# Altium project 8bit-counter.PrjPcb
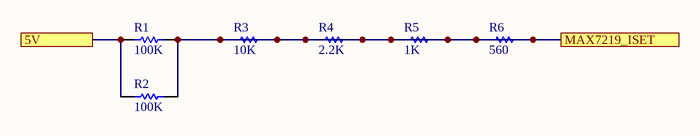
[diagram p0: Equivalent Resistance ISET.SchDoc]
5 sheets, 25 parts. Net scope: flat (ports and power ports of the same name join across sheets).
Sheets:
  Equivalent Resistance ISET.SchDoc
  Equivalent Inductance 3V3.SchDoc
  Equivalent Resistance RFBT 3V3.SchDoc
  3V3 SMPS.SchDoc
  Equivalent Resistance RFBT 5V.SchDoc

## Sheet Equivalent Resistance ISET.SchDoc
size A; SheetNumber: 1; SheetTotal: 3

### Parts
(Parts that share a designator on the sheet are numbered #1, #2 ... from top to bottom, then left to right.)
R1#1  value 100K  (hidden comment: Resistor)
R2#1  value 100K  (hidden comment: Resistor)
R3#1  value 10K  (hidden comment: Resistor)
R4#1  value 2.2K  (hidden comment: Resistor)
R5  value 1K  (hidden comment: Resistor)
R6  value 560  (hidden comment: Resistor)

### Ports
5V (see Equivalent Resistance RFBT 3V3[1B]), MAX7219_ISET (see Equivalent Resistance RFBT 3V3[3B])

### Nets
NetR1#1_1: R1#1.1 R2#1.2 ; port 5V
NetR1#1_2: R1#1.2 R2#1.1 R3#1.1 R3#1.2 R4#1.1 R4#1.2 R5.1 R5.2 R6.1 R6.2 ; port MAX7219_ISET

### Library data of the parts
R1#1 R2#1 R3#1 R4#1 R5 R6 = Resistor: TC1: 0; SimulationGenericComponent: True; TC2: 0

## Sheet Equivalent Inductance 3V3.SchDoc
size A; SheetNumber: 2; SheetTotal: 3
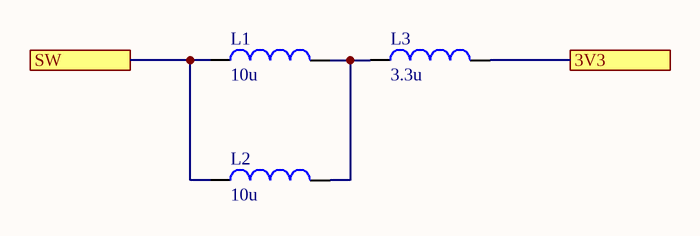
[diagram p1: Equivalent Inductance 3V3.SchDoc]

### Parts
(Parts that share a designator on the sheet are numbered #1, #2 ... from top to bottom, then left to right.)
L1#1  value 10u  (hidden comment: Inductor)
L2  value 10u  (hidden comment: Inductor)
L3  value 3.3u  (hidden comment: Inductor)

### Ports
3V3, SW

### Nets
NetL1#1_1: L1#1.1 L2.1 ; port SW
NetL1#1_2: L1#1.2 L2.2 L3.1
NetL3_2: L3.2 ; port 3V3

### Library data of the parts
L1#1 L2 L3 = Inductor: SimulationGenericComponent: True

## Sheet Equivalent Resistance RFBT 3V3.SchDoc
size A; SheetNumber: 3; SheetTotal: 3
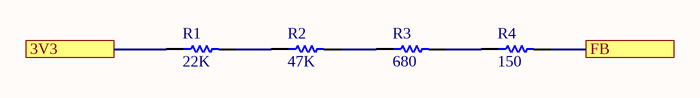
[diagram p2: Equivalent Resistance RFBT 3V3.SchDoc]

### Parts
(Parts that share a designator on the sheet are numbered #1, #2 ... from top to bottom, then left to right.)
R1#2  value 22K  (hidden comment: Resistor)
R2#2  value 47K  (hidden comment: Resistor)
R3#2  value 680  (hidden comment: Resistor)
R4#2  value 150  (hidden comment: Resistor)

### Ports
3V3 (see Equivalent Inductance 3V3[3B]), FB

### Nets
NetL3_2: R1#2.1 ; port 3V3
NetR1#2_2: R1#2.2 R2#2.1
NetR2#2_2: R2#2.2 R3#2.1
NetR3#2_2: R3#2.2 R4#2.1
NetR4#2_2: R4#2.2 ; port FB

### Library data of the parts
R1#2 R2#2 R3#2 R4#2 = Resistor: TC1: 0; SimulationGenericComponent: True; TC2: 0

## Sheet 3V3 SMPS.SchDoc
size A; SheetNumber: 4; SheetTotal: 4
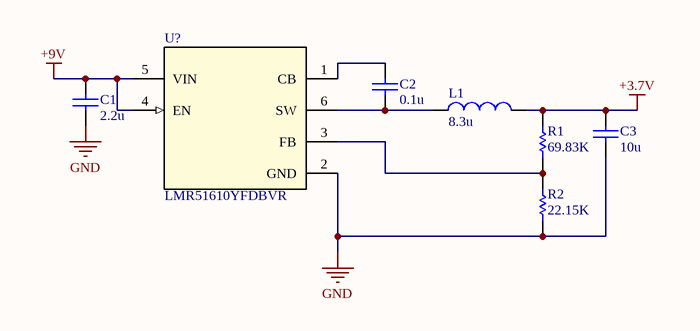
[diagram p3: 3V3 SMPS.SchDoc]

### Parts
(Parts that share a designator on the sheet are numbered #1, #2 ... from top to bottom, then left to right.)
C1  value 2.2u  (hidden comment: Capacitor)
C2  value 0.1u  (hidden comment: Capacitor)
C3  value 10u  (hidden comment: Capacitor)
L1#2  value 8.3u  (hidden comment: Inductor)
R1#3  value 69.83K  (hidden comment: Resistor)
R2#3  value 22.15K  (hidden comment: Resistor)
U?  LMR51610YFDBVR  [DBV0006A-IPC_A]

### Nets
+3.7V: C3.2 L1#2.2 R1#3.2
+9V: C1.2 U?.4(EN) U?.5(VIN)
GND: C1.1 C3.1 R2#3.1 U?.2(GND)
NetC2_1: C2.1 L1#2.1 U?.6(SW)
NetC2_2: C2.2 U?.1(CB)
NetR1#3_1: R1#3.1 R2#3.2 U?.3(FB)

### Library data of the parts
C1-C3 = Capacitor: SimulationGenericComponent: True
L1#2 = Inductor: SimulationGenericComponent: True
R1#3 R2#3 = Resistor: TC1: 0; SimulationGenericComponent: True; TC2: 0
U? = LMR51610YFDBVR: No Description Available; Mfr_Name: Texas Instruments; TYPE: TYPE; RefDes: RefDes

## Sheet Equivalent Resistance RFBT 5V.SchDoc
size A; SheetNumber: 5; SheetTotal: 6
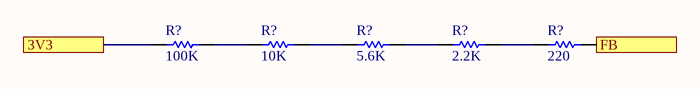
[diagram p4: Equivalent Resistance RFBT 5V.SchDoc]

### Parts
(Parts that share a designator on the sheet are numbered #1, #2 ... from top to bottom, then left to right.)
R?#1  value 100K  (hidden comment: Resistor)
R?#2  value 10K  (hidden comment: Resistor)
R?#3  value 5.6K  (hidden comment: Resistor)
R?#4  value 2.2K  (hidden comment: Resistor)
R?#5  value 220  (hidden comment: Resistor)

### Ports
3V3 (see Equivalent Inductance 3V3[3B], Equivalent Resistance RFBT 3V3[2B]), FB (see Equivalent Resistance RFBT 3V3[3B])

### Nets
NetL3_2: R?#1.1 ; port 3V3
NetR4#2_2: R?#5.2 ; port FB
NetR?#1_2: R?#1.2 R?#2.1
NetR?#2_2: R?#2.2 R?#3.1
NetR?#3_2: R?#3.2 R?#4.1
NetR?#4_2: R?#4.2 R?#5.1

### Library data of the parts
R?#1-R?#5 = Resistor: TC1: 0; SimulationGenericComponent: True; TC2: 0

## Nets that join several sheets
NetL3_2: Equivalent Inductance 3V3 (L3.2), Equivalent Resistance RFBT 3V3 (R1#2.1), Equivalent Resistance RFBT 5V (R?#1.1)
NetR4#2_2: Equivalent Resistance RFBT 3V3 (R4#2.2), Equivalent Resistance RFBT 5V (R?#5.2)